# Altium schematic sheet electrode.SchDoc
size 254 x 152 mm
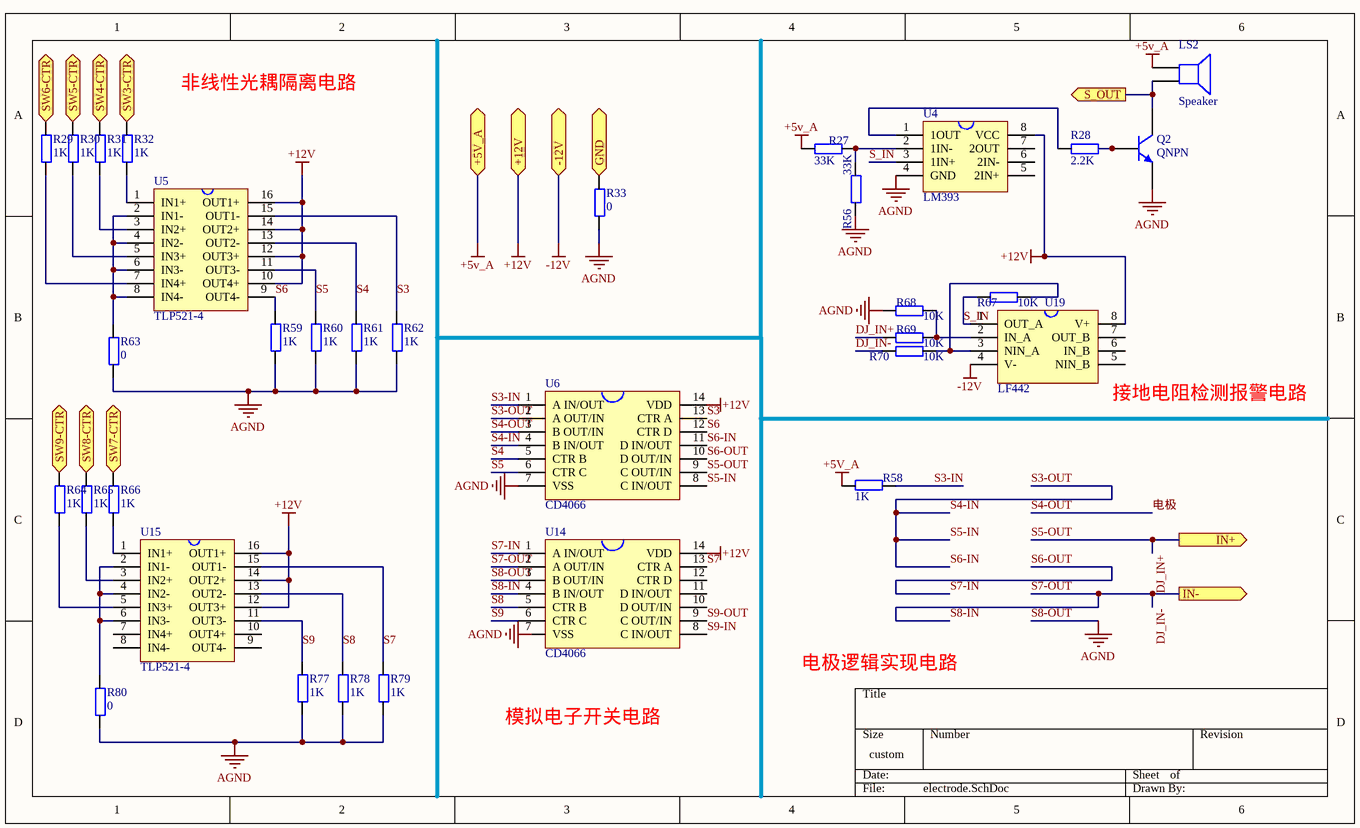
[diagram p0: electrode.SchDoc]

## Parts
LS2  Speaker  [PIN2]
Q2  QNPN  [SOT-23B_N]
R27  33K  [0603P]
R28  2.2K  [0603P]
R29  1K  [0603P]
R30  1K  [0603P]
R31  1K  [0603P]
R32  1K  [0603P]
R33  0  [0603P]
R56  33K  [0603P]
R58  1K  [0603P]
R59  1K  [0603P]
R60  1K  [0603P]
R61  1K  [0603P]
R62  1K  [0603P]
R63  0  [0603P]
R64  1K  [0603P]
R65  1K  [0603P]
R66  1K  [0603P]
R67  10K  [0603P]
R68  10K  [0603P]
R69  10K  [0603P]
R70  10K  [0603P]
R77  1K  [0603P]
R78  1K  [0603P]
R79  1K  [0603P]
R80  0  [0603P]
U4  LM393  [R-PDSO-G8]
U5  TLP521-4  [11-20A3]
U6  CD4066  [R-PDSO-G14]
U14  CD4066  [R-PDSO-G14]
U15  TLP521-4  [11-20A3]
U19  LF442  [R-DIP-T8]

## Ports
+5V_A, +12V, -12V, GND, IN+ (out), IN- (out), S_OUT (out), SW3-CTR (in), SW4-CTR (in), SW5-CTR (in), SW6-CTR (in), SW7-CTR (in), SW8-CTR (in), SW9-CTR (in)

## Nets
+5v_A: LS2.1 R27.1 R58.2 ; port +5V_A
+12V: U4.8(VCC) U5.10(OUT4+) U5.12(OUT3+) U5.14(OUT2+) U5.16(OUT1+) U6.14(VDD) U14.14(VDD) U15.12(OUT3+) U15.14(OUT2+) U15.16(OUT1+) U19.8(V+) ; port +12V
-12V: U19.4(V-) ; port -12V
S8-OUT: Q2.3(E) R33.1 R56.1 R59.1 R60.1 R61.1 R62.1 R63.1 R68.1 R77.1 R78.1 R79.1 R80.1 U4.4(GND) U6.7(VSS) U14.3(B_OUT/IN)  [also labelled AGND]
DJ_IN+: R69.1 U6.9(C_OUT/IN) ; port IN+  [also labelled S5-OUT]
DJ_IN-: R70.1 U14.2(A_OUT/IN) U14.4(B_IN/OUT) ; port IN-  [also labelled S7-OUT, S8-IN]
GND: R33.2 ; port GND
S3: R62.2 U5.15(OUT1-) U6.13(CTR_A)
S3-IN: R58.1 U6.1(A_IN/OUT)
S3-OUT: U6.2(A_OUT/IN) U6.4(B_IN/OUT) U6.8(C_IN/OUT) U6.11(D_IN/OUT)  [also labelled S4-IN, S5-IN, S6-IN]
S4: R61.2 U5.13(OUT2-) U6.5(CTR_B)
S4-OUT: U6.3(B_OUT/IN)  [also labelled 电极]
S5: R60.2 U5.11(OUT3-) U6.6(CTR_C)
S6: R59.2 U5.9(OUT4-) U6.12(CTR_D)
S6-OUT: U6.10(D_OUT/IN) U14.1(A_IN/OUT)  [also labelled S7-IN]
S7: R79.2 U14.13(CTR_A) U15.15(OUT1-)
S8: R78.2 U14.5(CTR_B) U15.13(OUT2-)
S9: R77.2 U14.6(CTR_C) U15.11(OUT3-)
S9-IN: U14.8(C_IN/OUT)
S9-OUT: U14.9(C_OUT/IN)
S_IN: R67.1 U4.3(1IN+) U19.1(OUT_A)
S_OUT: LS2.2 Q2.1(C) ; port S_OUT
SW3-CTR: R32.2 ; port SW3-CTR
SW4-CTR: R31.2 ; port SW4-CTR
SW5-CTR: R30.2 ; port SW5-CTR
SW6-CTR: R29.2 ; port SW6-CTR
SW7-CTR: R66.2 ; port SW7-CTR
SW8-CTR: R65.2 ; port SW8-CTR
SW9-CTR: R64.2 ; port SW9-CTR
NetQ2_2: Q2.2(B) R28.2
NetR27_2: R27.2 R56.2 U4.2(1IN-)
NetR28_1: R28.1 U4.1(1OUT)
NetR29_1: R29.1 U5.7(IN4+)
NetR30_1: R30.1 U5.5(IN3+)
NetR31_1: R31.1 U5.3(IN2+)
NetR32_1: R32.1 U5.1(IN1+)
NetR63_2: R63.2 U5.2(IN1-) U5.4(IN2-) U5.6(IN3-) U5.8(IN4-)
NetR64_1: R64.1 U15.5(IN3+)
NetR65_1: R65.1 U15.3(IN2+)
NetR66_1: R66.1 U15.1(IN1+)
NetR67_2: R67.2 R70.2 U19.3(NIN_A)
NetR68_2: R68.2 R69.2 U19.2(IN_A)
NetR80_2: R80.2 U15.2(IN1-) U15.4(IN2-) U15.6(IN3-)

Not connected (* = marked no-connect by the designer): U4 5(2IN+) 6(2IN-) 7(2OUT); U14 7(VSS) 10(D_OUT/IN) 11(D_IN/OUT) 12(CTR_D); U15 7(IN4+) 8(IN4-) 9(OUT4-) 10(OUT4+); U19 5(NIN_B) 6(IN_B) 7(OUT_B)

## Notes on the sheet
- 非线性光耦隔离电路
- (near U19) 接地电阻检测报警电路
- 电极逻辑实现电路
- 模拟电子开关电路
- Labels drawn without touching a wire or pin: AGND

## Library data of the parts
LS2 = Speaker: Loudspeaker; Published: 24-Mar-1999; LatestRevisionDate: 17-Jul-2002; LatestRevisionNote: Re-released for DXP Platform.; PackageReference: PIN2; Publisher: Altium Limited
Q2 = QNPN: NPN Bipolar Transistor; Published: 8-Jun-2000; LatestRevisionDate: 29-May-2009; LatestRevisionNote: IPC-7351 Footprint Added.; PackageVersion: Aug-1999; PackageReference: SOT-23B; Publisher: Altium Limited; PackageDescription: 3-Pin SOT-23 Package 0.95 mm Pitch, 2.4 mm Lead Span
R27-R33 R56 R58-R70 R77-R80 = R
U5 U15 = TLP521